# Altium project 主板工程.PrjPCB
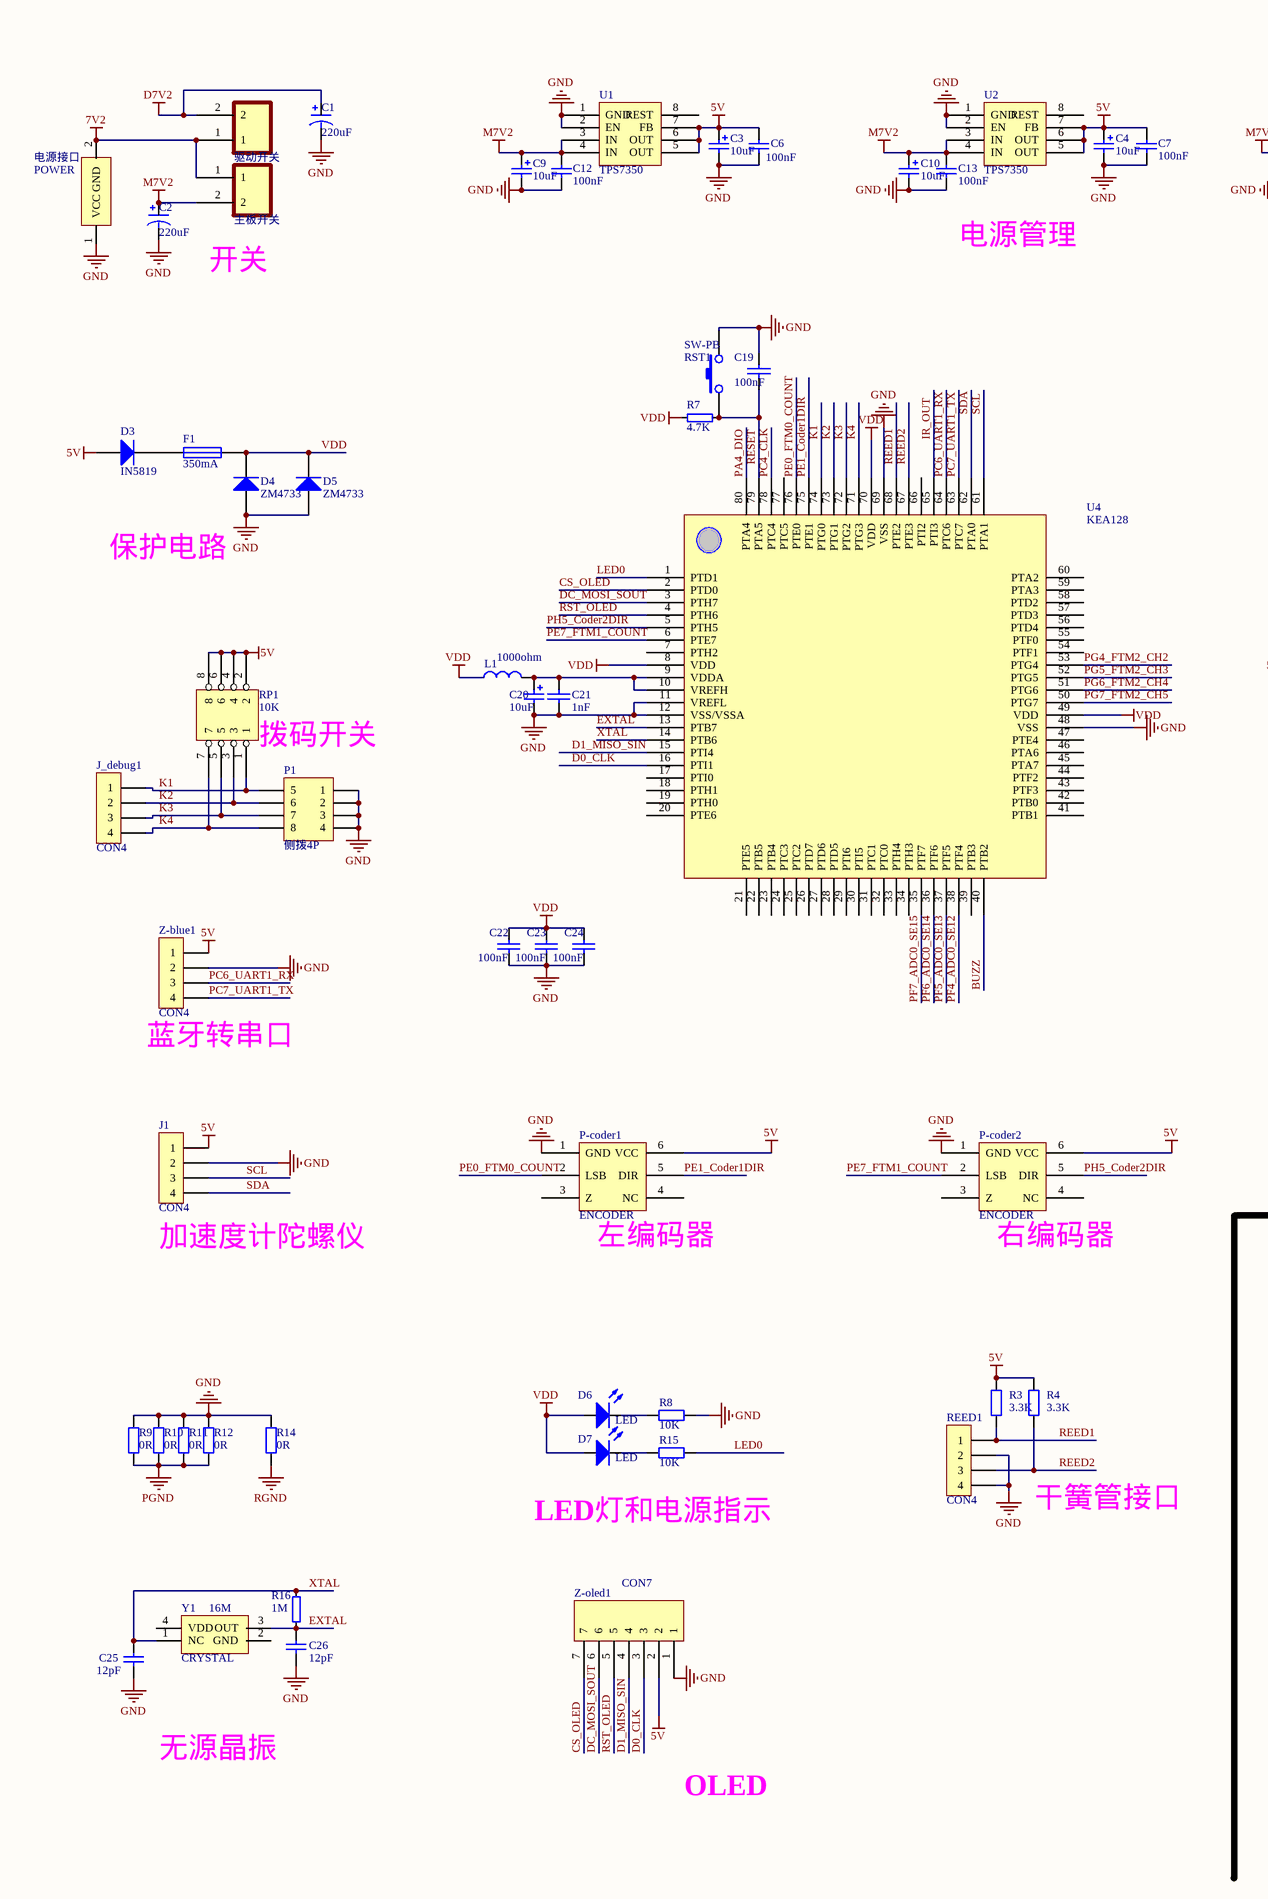
[diagram p0: 第十三届电磁Sheet.SchDoc, left]
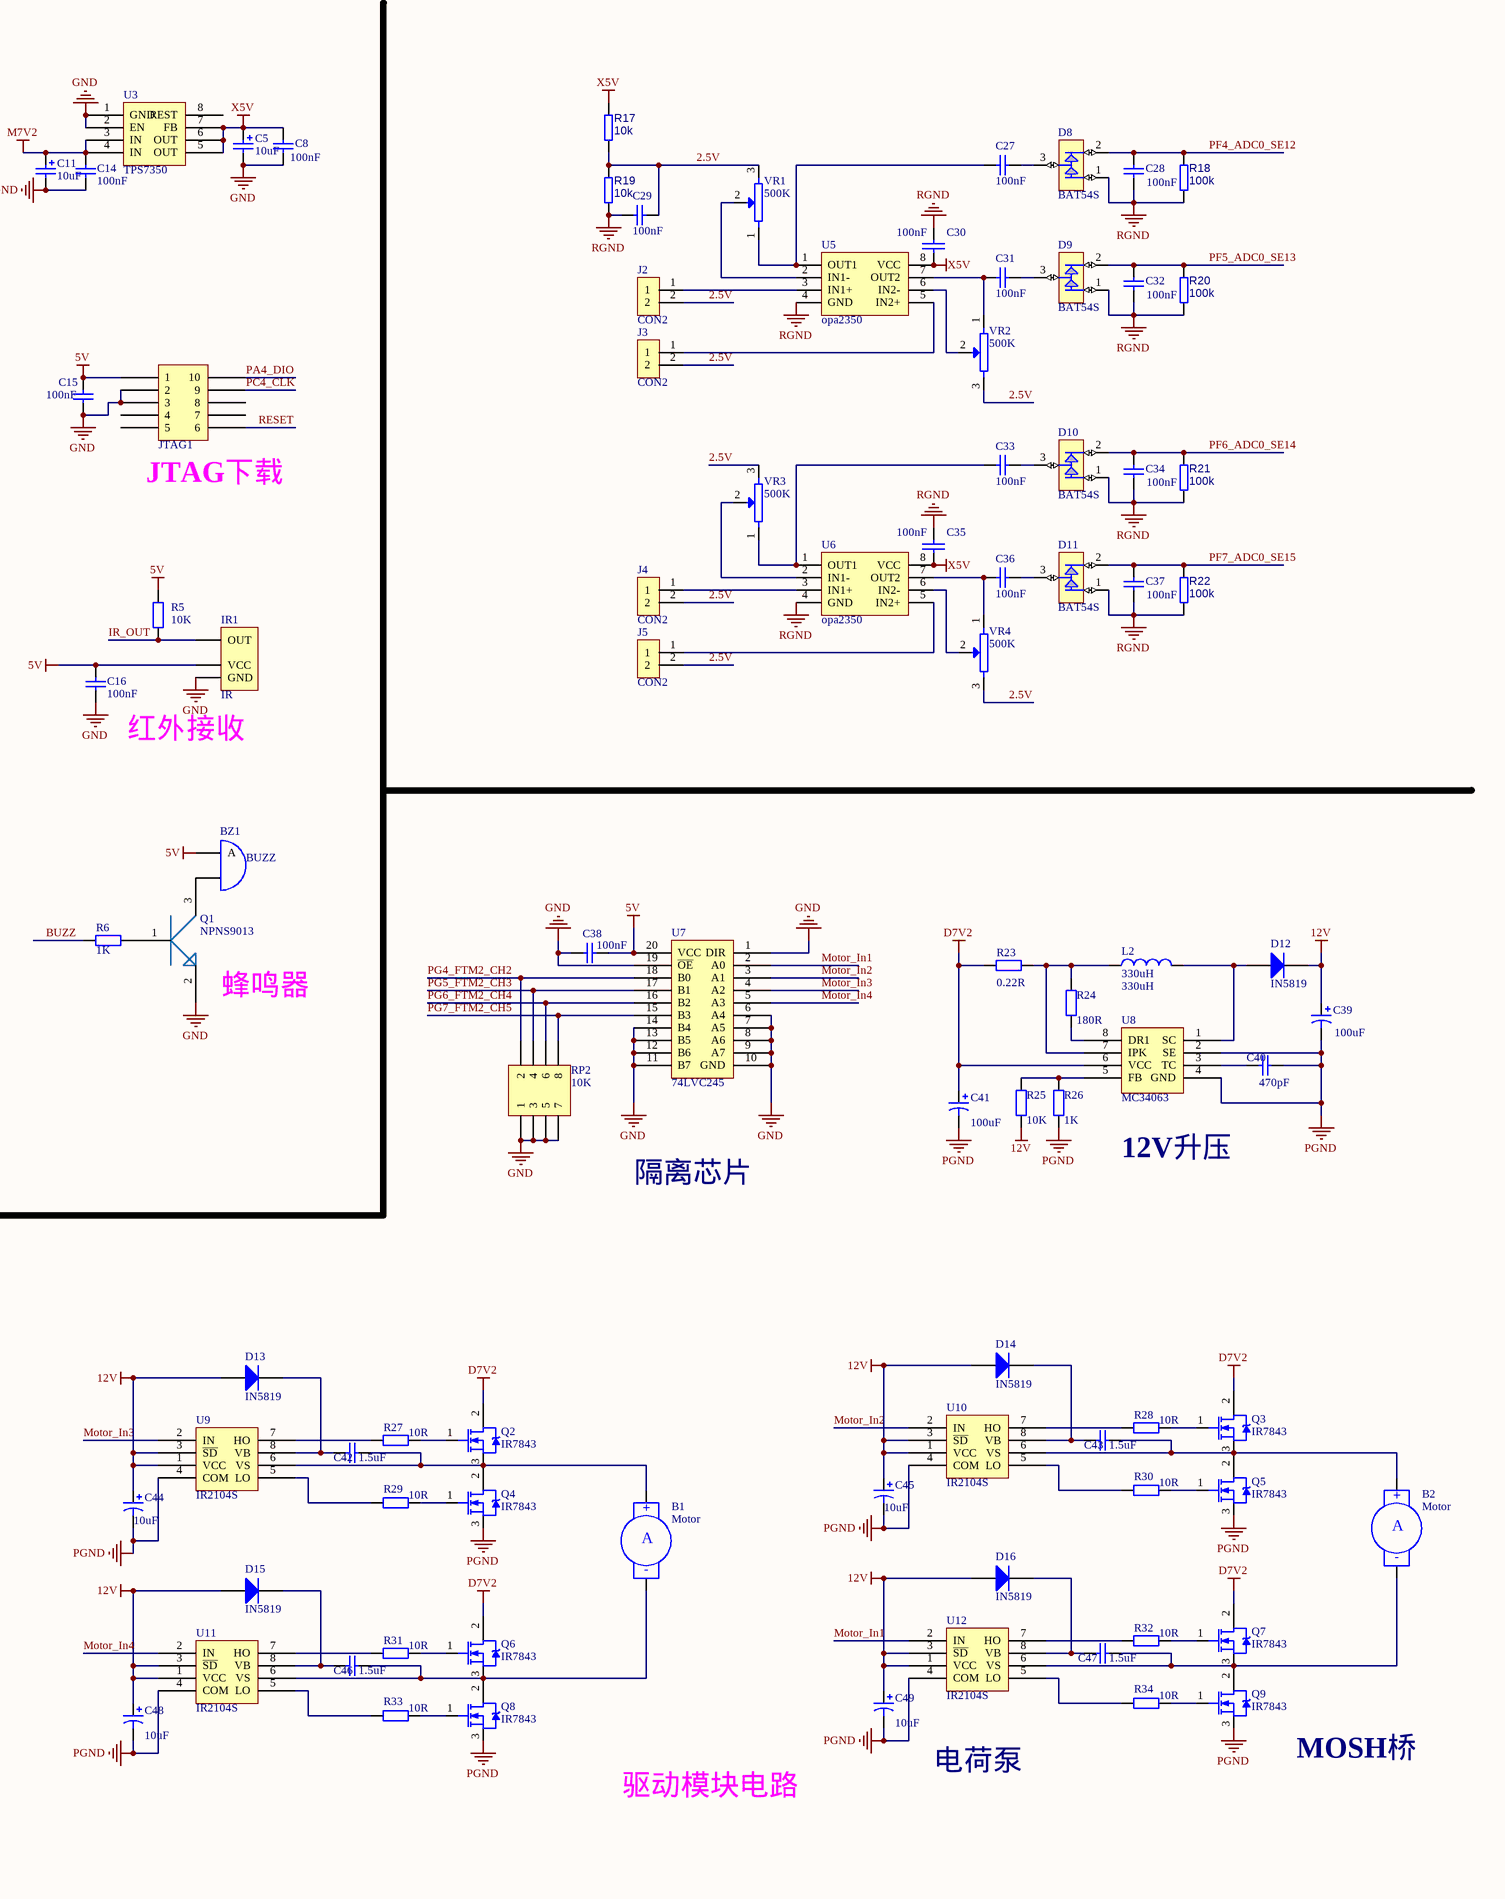
[diagram p1: 第十三届电磁Sheet.SchDoc, right]
1 sheet, 144 parts. Net scope: global (net labels, ports and power ports of the same name join across sheets).
Board file: 第十三届电磁PCB.PcbDoc

## Sheet 第十三届电磁Sheet.SchDoc
size A2

### Parts
B1  Motor  [KF301-2P]
B2  Motor  [KF301-2P]
BZ1  BUZZ  [BUZZ]
C1  220uF  [铝电解电容10*10.2]
C2  220uF  [铝电解电容10*10.2]
C3  10uF  [3216]
C4  10uF  [3216]
C5  10uF  [3216]
C6  100nF  [0603(1608)]
C7  100nF  [0603(1608)]
C8  100nF  [0603(1608)]
C9  10uF  [3216]
C10  10uF  [3216]
C11  10uF  [3216]
C12  100nF  [0603(1608)]
C13  100nF  [0603(1608)]
C14  100nF  [0603(1608)]
C15  100nF  [0603(1608)]
C16  100nF  [0603(1608)]
C19  100nF  [0603(1608)]
C20  10uF  [3216]
C21  1nF  [0603(1608)]
C22  100nF  [0603(1608)]
C23  100nF  [0603(1608)]
C24  100nF  [0603(1608)]
C25  12pF  [0603(1608)]
C26  12pF  [0603(1608)]
C27  100nF  [0603(1608)]
C28  100nF  [0603(1608)]
C29  100nF  [0603(1608)]
C30  100nF  [0603(1608)]
C31  100nF  [0603(1608)]
C32  100nF  [0603(1608)]
C33  100nF  [0603(1608)]
C34  100nF  [0603(1608)]
C35  100nF  [0603(1608)]
C36  100nF  [0603(1608)]
C37  100nF  [0603(1608)]
C38  100nF  [0603(1608)]
C39  100uF  [TAN-D7343]
C40  470pF  [0603(1608)]
C41  100uF  [TAN-D7343]
C42  1.5uF  [0603(1608)]
C43  1.5uF  [0603(1608)]
C44  10uF  [Tan-A3216]
C45  10uF  [Tan-A3216]
C46  1.5uF  [0603(1608)]
C47  1.5uF  [0603(1608)]
C48  10uF  [Tan-A3216]
C49  10uF  [Tan-A3216]
D3  IN5819  [LC-SOD-123]
D4  ZM4733  [稳压管]
D5  ZM4733  [稳压管]
D6  LED  [0603LED]
D7  LED  [0603LED]
D8  BAT54S  [SOT23]
D9  BAT54S  [SOT23]
D10  BAT54S  [SOT23]
D11  BAT54S  [SOT23]
D12  IN5819  [LC-SOD-123]
D13  IN5819  [LC-SOD-123]
D14  IN5819  [LC-SOD-123]
D15  IN5819  [LC-SOD-123]
D16  IN5819  [LC-SOD-123]
F1  350mA  [FUSE-1206]
IR1  IR  [HS0038]
J1  CON4  [CON4-1]
J2  CON2  [CON2]
J3  CON2  [CON2]
J4  CON2  [CON2]
J5  CON2  [CON2]
J_debug1  CON4  [CON4-1]
JTAG1  JTAG  [IDC5X2]  (value not drawn)
L1  1000ohm  [0805 - duplicate]
L2  330uH  [贴片电感7*7*4]
P1  侧拨4P  [侧拨4P]
P-coder1  ENCODER  [ENCODER]
P-coder2  ENCODER  [ENCODER]
POWER  电源接口  [KF301-2P]
Q1  NPNS9013  [LC-SOT-23(SOT-23-3)]
Q2  IR7843  [LR7843]
Q3  IR7843  [LR7843]
Q4  IR7843  [LR7843 - no via]
Q5  IR7843  [LR7843 - no via]
Q6  IR7843  [LR7843]
Q7  IR7843  [LR7843]
Q8  IR7843  [LR7843 - no via]
Q9  IR7843  [LR7843 - no via]
R3  3.3K  [0603(1608)]
R4  3.3K  [0603(1608)]
R5  10K  [0603(1608)]
R6  1K  [0603(1608)]
R7  4.7K  [0603(1608)]
R8  10K  [0603(1608)]
R9  0R  [0805(2012)]
R10  0R  [0805(2012)]
R11  0R  [0805(2012)]
R12  0R  [0805(2012)]
R14  0R  [0805(2012)]
R15  10K  [0603(1608)]
R16  1M  [0603(1608)]
R17  10k  [0603(1608)]
R18  100k  [0603(1608)]
R19  10k  [0603(1608)]
R20  100k  [0603(1608)]
R21  100k  [0603(1608)]
R22  100k  [0603(1608)]
R23  0.22R  [0603(1608)]
R24  180R  [0603(1608)]
R25  10K  [0603(1608)]
R26  1K  [0603(1608)]
R27  10R  [0603(1608)]
R28  10R  [0603(1608)]
R29  10R  [0603(1608)]
R30  10R  [0603(1608)]
R31  10R  [0603(1608)]
R32  10R  [0603(1608)]
R33  10R  [0603(1608)]
R34  10R  [0603(1608)]
REED1  CON4  [CON4-1]
RP1  10K  [RA_8]
RP2  10K  [RA_8]
RST1  SW-PB  [SMT_BUTTON]
U1  TPS7350  [SOIC-8]
U2  TPS7350  [SOIC-8]
U3  TPS7350  [SOIC-8]
U4  KEA128  [LQFP-80M]
U5  opa2350  [SO8]
U6  opa2350  [SO8]
U7  74LVC245  [74LVC245 TSSOP]
U8  MC34063  [MC34063]
U9  IR2104S  [IR2104]
U10  IR2104S  [IR2104]
U11  IR2104S  [IR2104]
U12  IR2104S  [IR2104]
VR1  500K  [电位器]
VR2  500K  [电位器]
VR3  500K  [电位器]
VR4  500K  [电位器]
Y1  CRYSTAL  [LC-SMD-3225_4P]
Z-blue1  CON4  [Bluetooth]
Z-oled1  CON7  [CON7_OLED]
主板开关1  主板开关  [船型开关-small]
驱动开关1  驱动开关  [船型开关-small]

### Nets
5V: BZ1.1(A) C3.1 C4.1 C6.2 C7.2 C15.2 C16.2 C38.2 D3.1(A) IR1.2(VCC) J1.1 JTAG1.1 P-coder1.6(VCC) P-coder2.6(VCC) R3.2 R4.2 R5.2 RP1.2 RP1.4 RP1.6 RP1.8 U1.5(OUT) U1.6(OUT) U1.7(FB) U2.5(OUT) U2.6(OUT) U2.7(FB) U7.20(VCC) Z-blue1.1 Z-oled1.2
7V2: POWER.2(GND) 主板开关1.1 驱动开关1.1
12V: C39.1 C44.1 C45.1 C48.1 C49.1 D12.2(K) D13.1(A) D14.1(A) D15.1(A) D16.1(A) R25.1 U9.1(VCC) U9.3(~{SD}) U10.1(VCC) U10.3(~{SD}) U11.1(VCC) U11.3(~{SD}) U12.1(VCC) U12.3(~{SD})
D7V2: C1.1 C41.1 Q2.2(D) Q3.2(D) Q6.2(D) Q7.2(D) R23.2 U8.6(VCC) 驱动开关1.2
GND: C1.2 C2.2 C3.2 C4.2 C5.2 C6.1 C7.1 C8.1 C9.2 C10.2 C11.2 C12.2 C13.1 C14.2 C15.1 C16.1 C19.2 C20.2 C21.1 C22.1 C23.1 C24.1 C25.1 C26.1 C38.1 D4.1(A) D5.1(A) IR1.1(GND) J1.2 JTAG1.2 JTAG1.3 P1.1 P1.2 P1.3 P1.4 P-coder1.1(GND) P-coder2.1(GND) POWER.1(VCC) Q1.2 R8.2 R9.2 R10.2 R11.2 R12.2 R14.2 REED1.2 REED1.4 RP2.1 RP2.3 RP2.5 RP2.7 RST1.2 U1.1(GND) U1.2(EN) U2.1(GND) U2.2(EN) U3.1(GND) U3.2(EN) U4.11(VREFL) U4.12(VSS/VSSA) U4.48(VSS) U4.69(VSS) U7.1(DIR) U7.6(A4) U7.7(A5) U7.8(A6) U7.9(A7) U7.10(GND) U7.11(B7) U7.12(B6) U7.13(B5) U7.14(B4) U7.19(~{OE}) Z-blue1.2 Z-oled1.1
M7V2: C2.1 C9.1 C10.1 C11.1 C12.1 C13.2 C14.1 U1.3(IN) U1.4(IN) U2.3(IN) U2.4(IN) U3.3(IN) U3.4(IN) 主板开关1.2
PGND: C39.2 C40.2 C41.2 C44.2 C45.2 C48.2 C49.2 Q4.3(S) Q5.3(S) Q8.3(S) Q9.3(S) R9.1 R10.1 R11.1 R12.1 R26.1 U8.2(SE) U8.4(GND) U9.4(COM) U10.4(COM) U11.4(COM) U12.4(COM)
RGND: C28.1 C29.2 C30.1 C32.1 C34.1 C35.1 C37.1 D8.1 D9.1 D10.1 D11.1 R14.1 R18.1 R19.1 R20.1 R21.1 R22.1 U5.4(GND) U6.4(GND)
VDD: C22.2 C23.2 C24.2 D4.2(K) D5.2(K) D6.1 D7.1 F1.2 L1.2 R7.1 U4.8(VDD) U4.49(VDD) U4.70(VDD)
X5V: C5.1 C8.2 C30.2 C35.2 R17.2 U3.5(OUT) U3.6(OUT) U3.7(FB) U5.8(VCC) U6.8(VCC)
2.5V: C29.1 J2.2 J3.2 J4.2 J5.2 R17.1 R19.2 VR1.3 VR2.3 VR3.3 VR4.3
BUZZ: R6.2 U4.40(PTB2)
CS_OLED: U4.2(PTD0) Z-oled1.7
D0_CLK: U4.16(PTI1) Z-oled1.3
D1_MISO_SIN: U4.15(PTI4) Z-oled1.4
DC_MOSI_SOUT: U4.3(PTH7) Z-oled1.6
EXTAL: C26.2 R16.2 U4.13(PTB7) Y1.3(OUT)
IR_OUT: IR1.3(OUT) R5.1 U4.65(PTI3)
K1: J_debug1.1 P1.5 RP1.1 U4.74(PTG0)
K2: J_debug1.2 P1.6 RP1.3 U4.73(PTG1)
K3: J_debug1.3 P1.7 RP1.5 U4.72(PTG2)
K4: J_debug1.4 P1.8 RP1.7 U4.71(PTG3)
LED0: R15.2 U4.1(PTD1)
Motor_In1: U7.2(A0) U12.2(IN)
Motor_In2: U7.3(A1) U10.2(IN)
Motor_In3: U7.4(A2) U9.2(IN)
Motor_In4: U7.5(A3) U11.2(IN)
PA4_DIO: JTAG1.10 U4.80(PTA4)
PC4_CLK: JTAG1.9 U4.78(PTC4)
PC6_UART1_RX: U4.64(PTC6) Z-blue1.3
PC7_UART1_TX: U4.63(PTC7) Z-blue1.4
PE0_FTM0_COUNT: P-coder1.2(LSB) U4.76(PTE0)
PE1_Coder1DIR: P-coder1.5(DIR) U4.75(PTE1)
PE7_FTM1_COUNT: P-coder2.2(LSB) U4.6(PTE7)
PF4_ADC0_SE12: C28.2 D8.2 R18.2 U4.38(PTF4)
PF5_ADC0_SE13: C32.2 D9.2 R20.2 U4.37(PTF5)
PF6_ADC0_SE14: C34.2 D10.2 R21.2 U4.36(PTF6)
PF7_ADC0_SE15: C37.2 D11.2 R22.2 U4.35(PTF7)
PG4_FTM2_CH2: RP2.2 U4.53(PTG4) U7.18(B0)
PG5_FTM2_CH3: RP2.4 U4.52(PTG5) U7.17(B1)
PG6_FTM2_CH4: RP2.6 U4.51(PTG6) U7.16(B2)
PG7_FTM2_CH5: RP2.8 U4.50(PTG7) U7.15(B3)
PH5_Coder2DIR: P-coder2.5(DIR) U4.5(PTH5)
REED1: R3.1 REED1.1 U4.68(PTE2)
REED2: R4.1 REED1.3 U4.67(PTE3)
RESET: C19.1 JTAG1.6 R7.2 RST1.1 U4.79(PTA5)
RST_OLED: U4.4(PTH6) Z-oled1.5
SCL: J1.3 U4.61(PTA1)
SDA: J1.4 U4.62(PTA0)
XTAL: C25.2 R16.1 U4.14(PTB6) Y1.1(NC)
NetB1_1: B1.1(+) C42.2 Q2.3(S) Q4.2(D) U9.6(VS)
NetB1_2: B1.2(-) C46.2 Q6.3(S) Q8.2(D) U11.6(VS)
NetB2_1: B2.1(+) C43.2 Q3.3(S) Q5.2(D) U10.6(VS)
NetB2_2: B2.2(-) C47.2 Q7.3(S) Q9.2(D) U12.6(VS)
NetBZ1_2: BZ1.2(B) Q1.3
NetC20_1: C20.1 C21.2 L1.1 U4.9(VDDA) U4.10(VREFH)
NetC27_1: C27.1 D8.3
NetC27_2: C27.2 U5.1(OUT1) VR1.1
NetC31_1: C31.1 D9.3
NetC31_2: C31.2 U5.7(OUT2) VR2.1
NetC33_1: C33.1 D10.3
NetC33_2: C33.2 U6.1(OUT1) VR3.1
NetC36_1: C36.1 D11.3
NetC36_2: C36.2 U6.7(OUT2) VR4.1
NetC40_1: C40.1 U8.3(TC)
NetC42_1: C42.1 D13.2(K) U9.8(VB)
NetC43_1: C43.1 D14.2(K) U10.8(VB)
NetC46_1: C46.1 D15.2(K) U11.8(VB)
NetC47_1: C47.1 D16.2(K) U12.8(VB)
NetD3_2: D3.2(K) F1.1
NetD6_2: D6.2 R8.1
NetD7_2: D7.2 R15.1
NetD12_1: D12.1(A) L2.2 U8.1(SC)
NetJ2_1: J2.1 U5.3(IN1+)
NetJ3_1: J3.1 U5.5(IN2+)
NetJ4_1: J4.1 U6.3(IN1+)
NetJ5_1: J5.1 U6.5(IN2+)
NetL2_1: L2.1 R23.1 R24.2 U8.7(IPK)
NetQ1_1: Q1.1 R6.1
NetQ2_1: Q2.1(G) R27.2
NetQ3_1: Q3.1(G) R28.2
NetQ4_1: Q4.1(G) R29.2
NetQ5_1: Q5.1(G) R30.2
NetQ6_1: Q6.1(G) R31.2
NetQ7_1: Q7.1(G) R32.2
NetQ8_1: Q8.1(G) R33.2
NetQ9_1: Q9.1(G) R34.2
NetR24_1: R24.1 U8.8(DR1)
NetR25_2: R25.2 R26.2 U8.5(FB)
NetR27_1: R27.1 U9.7(HO)
NetR28_1: R28.1 U10.7(HO)
NetR29_1: R29.1 U9.5(LO)
NetR30_1: R30.1 U10.5(LO)
NetR31_1: R31.1 U11.7(HO)
NetR32_1: R32.1 U12.7(HO)
NetR33_1: R33.1 U11.5(LO)
NetR34_1: R34.1 U12.5(LO)
NetU5_2: U5.2(IN1-) VR1.2
NetU5_6: U5.6(IN2-) VR2.2
NetU6_2: U6.2(IN1-) VR3.2
NetU6_6: U6.6(IN2-) VR4.2

Not connected (* = marked no-connect by the designer): JTAG1 4 5 7 8; P-coder1 3(Z) 4(NC); P-coder2 3(Z) 4(NC); U1 8(REST); U2 8(REST); U3 8(REST); U4 7(PTH2) 17(PTI0) 18(PTH1) 19(PTH0) 20(PTE6) 21(PTE5) 22(PTB5) 23(PTB4) 24(PTC3) 25(PTC2) 26(PTD7) 27(PTD6) 28(PTD5) 29(PTI6) 30(PTI5) 31(PTC1) 32(PTC0) 33(PTH4) 34(PTH3) 39(PTB3) 41(PTB1) 42(PTB0) 43(PTF3) 44(PTF2) 45(PTA7) 46(PTA6) 47(PTE4) 54(PTF1) 55(PTF0) 56(PTD4) 57(PTD3) 58(PTD2) 59(PTA3) 60(PTA2) 66(PTI2) 77(PTC5); Y1 2(GND) 4(VDD)

### Notes on the sheet
- 电源管理
- 开关
- (near JTAG1) JTAG下载
- 保护电路
- (near RP1) 拨码开关
- 红外接收
- (near Q1) 蜂鸣器
- (near Z-blue1) 蓝牙转串口
- 隔离芯片
- 12V升压
- (near J1) 加速度计陀螺仪
- (near P-coder1) 左编码器
- (near P-coder2) 右编码器
- 干簧管接口
- LED灯和电源指示
- 无源晶振
- MOSH桥
- OLED
- 驱动模块电路
- 电荷泵
- Title
- Size:
- Date:
- File:
- A2
- Number:
- Time:
- Revision:
- Sheet
- of
- (in symbol CRYSTAL) 16M
- (in symbol Motor Servo) A

### Library data of the parts
B1 B2 = Motor Servo: Servo Motor
C1 C2 = CAP2: 电容带极性; value: 220uF
C3-C5 C9-C11 C20 = 电容
C6-C8 C12-C15 C38 C40 C42 C43 C46 C47 = Cap: Capacitor
  C38: Published: 8-Jun-2000; LatestRevisionDate: 17-Jul-2002; LatestRevisionNote: Re-released for DXP Platform.; PackageReference: RAD-0.3; Publisher: Altium Limited; PackageDescription: Radial Cap, Thru-Hole; 2 Leads; 0.3 in Pin Spacing; Value: 100nF
  C40: Published: 8-Jun-2000; LatestRevisionDate: 17-Jul-2002; LatestRevisionNote: Re-released for DXP Platform.; PackageReference: RAD-0.3; Publisher: Altium Limited; PackageDescription: Radial Cap, Thru-Hole; 2 Leads; 0.3 in Pin Spacing; Value: 470pF
  C42 C43 C46 C47: Published: 8-Jun-2000; LatestRevisionDate: 17-Jul-2002; LatestRevisionNote: Re-released for DXP Platform.; PackageReference: RAD-0.3; Publisher: Altium Limited; PackageDescription: Radial Cap, Thru-Hole; 2 Leads; 0.3 in Pin Spacing; Value: 1.5uF
C16 C25 C26 = Cap_1: Capacitor; Published: 8-Jun-2000; LatestRevisionDate: 17-Jul-2002; LatestRevisionNote: Re-released for DXP Platform.; PackageReference: RAD-0.3; Publisher: Altium Limited; PackageDescription: Radial Cap, Thru-Hole; 2 Leads; 0.3 in Pin Spacing
  C16: Value: 100nF
  C25 C26: Value: 12pF
C19 C21-C24 C30 C35 = 普通电容: Capacitor
C27-C29 C31-C34 C36 C37 = Cap Semi: Capacitor (Semiconductor SIM Model); Value2: 10uF; Published: 8-Jun-2000; LatestRevisionDate: 17-Jul-2002; LatestRevisionNote: Re-released for DXP Platform.; PackageReference: C1206; Publisher: Altium Limited; value1: 100nF
C39 C41 C44 C45 C48 C49 = Cap Pol1: Polarized Capacitor (Radial); Published: 8-Jun-2000; LatestRevisionDate: 17-Jul-2002; LatestRevisionNote: Re-released for DXP Platform.; PackageReference: RB7.6-15; Publisher: Altium Limited; PackageDescription: Polarized Capacitor (Radial); 2 Leads
  C39 C41: Value: 100uF
  C44 C45 C48 C49: Value: 10uF
D3-D5 D12-D16 = Diode: Default Diode; Published: 8-Jun-2000; LatestRevisionDate: 17-Jul-2002; LatestRevisionNote: Re-released for DXP Platform.; PackageVersion: Sep-1996; PackageReference: SMC; Publisher: Altium Limited; PackageDescription: DO-214-AB/SMC; 2 C-Bend Leads; Body 7.9 x 5.9 mm, inc. leads (LxW); Code_JEDEC: DO-214-AB
D6 D7 = LED: Typical INFRARED GaAs LED
D8-D11 = BAT54S: 小信号肖特基二极管,峰值反向电压30 V,0.2A
F1 = Fuse 1: Fuse; Published: 8-Jun-2000; LatestRevisionDate: 17-Jul-2002; LatestRevisionNote: Re-released for DXP Platform.; PackageReference: PIN-W2/E2.8; Publisher: Altium Limited
IR1 = IR_2
L1 = L
L2 = Inductor: Code_IEC: 1005; Published: 8-Jun-2000; LatestRevisionDate: 29-May-2009; LatestRevisionNote: IPC-7351 Footprint Added.; PackageReference: 0402-A; Publisher: Altium Limited; PackageDescription: Chip Inductor; Code_JEITA: 0402; Value: 330uH
POWER = 电源接口: 2P
Q1 = S9013
Q2-Q9 = NMOS-2: N-Channel Power MOSFET; Note: Pin 2 is electrically connected to pin 4.; Published: 8-Jun-2000; LatestRevisionDate: 17-Jul-2002; LatestRevisionNote: Re-released for DXP Platform.; DatasheetVersion: PD-9.814; PackageVersion: Feb-1997; PackageReference: TO-220AB; Publisher: Altium Limited; PackageDescription: TO, Thru-Hole, Vertical, Heatsink Mounted; 3 In-Line Leads; Pitch 2.54 mm; ComponentLink1Description: Manufacturer Link; ComponentLink1URL: http://www.irf.com/
R3-R6 = Res2_2: Resistor; Published: 8-Jun-2000; LatestRevisionDate: 17-Jul-2002; LatestRevisionNote: Re-released for DXP Platform.; PackageReference: AXIAL-0.4; Publisher: Altium Limited; PackageDescription: Axial Device, Thru-Hole; 2 Leads; 0.4 in Pin Spacing
  R3 R4: Value: 3.3K
  R5: Value: 10K
  R6: Value: 1K
R7 R9-R12 R14 R16 = RES
R8 R15 = Res2_1: Resistor; Published: 8-Jun-2000; LatestRevisionDate: 17-Jul-2002; LatestRevisionNote: Re-released for DXP Platform.; PackageReference: AXIAL-0.4; Publisher: Altium Limited; PackageDescription: Axial Device, Thru-Hole; 2 Leads; 0.4 in Pin Spacing; Value: 10K
R17-R22 = RES: 单个电阻; Published: 8-Jun-2000; LatestRevisionDate: 17-Jul-2002; LatestRevisionNote: Re-released for DXP Platform.; PackageReference: AXIAL-0.4; Publisher: Altium Limited
R23-R34 = Res2: Resistor; Published: 8-Jun-2000; LatestRevisionDate: 17-Jul-2002; LatestRevisionNote: Re-released for DXP Platform.; PackageReference: AXIAL-0.4; Publisher: Altium Limited; PackageDescription: Axial Device, Thru-Hole; 2 Leads; 0.4 in Pin Spacing
  R23: Value: 0.22R
  R24: Value: 180R
  R25: Value: 10K
  R26: Value: 1K
  R27-R34: Value: 10R
RP1 = HEADER4*2: value: 10K
RP2 = Header 4X2: Header, 4-Pin, Dual row; LatestRevisionDate: 17-Jul-2002; LatestRevisionNote: Re-released for DXP Platform.; Publisher: Altium Limited
RST1 = 微动开关
U1-U3 = TPS
U4 = KEA128-80
U5 U6 = opa2350: 放大器
VR1-VR4 = VR: 3端可调电阻
主板开关1 驱动开关1 = 船型开关